# Altium schematic sheet coilcube_frontend_v2.SchDoc
size Letter
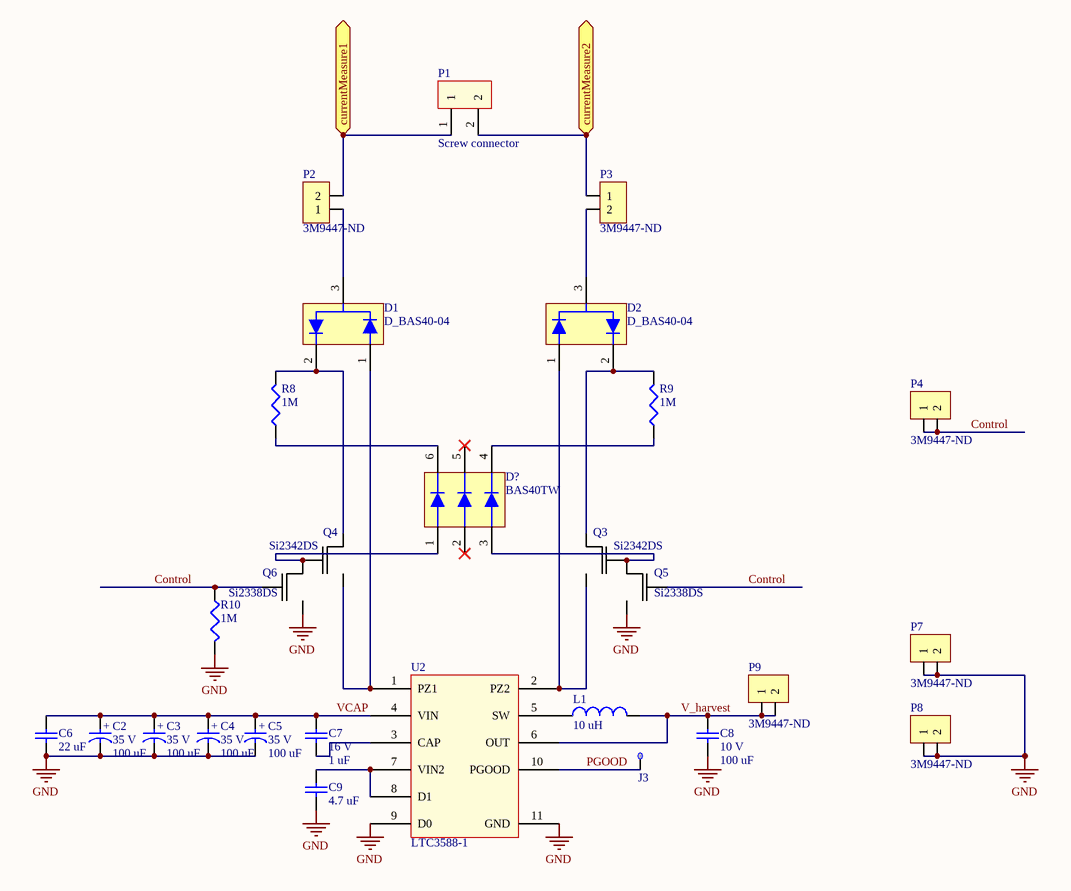
[diagram p0: coilcube_frontend_v2.SchDoc]

## Parts
C2  value 100 uF  voltage rated: 35 V  [KEMET_EDK_9H]  (hidden comment: Aluminum capacitor)
C3  value 100 uF  voltage rated: 35 V  [KEMET_EDK_9H]  (hidden comment: Aluminum capacitor)
C4  value 100 uF  voltage rated: 35 V  [KEMET_EDK_9H]  (hidden comment: Aluminum capacitor)
C5  value 100 uF  voltage rated: 35 V  [KEMET_EDK_9H]  (hidden comment: Aluminum capacitor)
C6  value 22 uF  [1206]  (hidden comment: Ceramic capacitor)
C7  value 1 uF  voltage rated: 16 V  [0603]  (hidden comment: Ceramic capacitor)
C8  value 100 uF  voltage rated: 10 V  [1210]  (hidden comment: Ceramic capacitor)
C9  value 4.7 uF  [0603]  (hidden comment: Ceramic capacitor)
D1  D_BAS40-04  [SOT23-3]
D2  D_BAS40-04  [SOT23-3]
D?  BAS40TW  [SOT-363]
J3  5004  [TestPoint]  (value not drawn)
L1  value 10 uH  [CDRH2D18]  (hidden comment: Chip inductor)
P1  Screw connector  [MPT_2position]
P2  Supplier Part Number 1: 3M9447-ND  [1x2 header]  (hidden comment: 1 x 2 header)
P3  Supplier Part Number 1: 3M9447-ND  [1x2 header]  (hidden comment: 1 x 2 header)
P4  Supplier Part Number 1: 3M9447-ND  [1x2 header]  (hidden comment: 1 x 2 header)
P7  Supplier Part Number 1: 3M9447-ND  [1x2 header]  (hidden comment: 1 x 2 header)
P8  Supplier Part Number 1: 3M9447-ND  [1x2 header]  (hidden comment: 1 x 2 header)
P9  Supplier Part Number 1: 3M9447-ND  [1x2 header]  (hidden comment: 1 x 2 header)
Q3  Si2342DS  [SOT23-3]
Q4  Si2342DS  [SOT23-3]
Q5  Si2338DS  [SOT23-3]
Q6  Si2338DS  [SOT23-3]
R8  value 1M  [0603]  (hidden comment: Chip resistor)
R9  value 1M  [0603]  (hidden comment: Chip resistor)
R10  value 1M  [0603]  (hidden comment: Chip resistor)
U2  LTC3588-1  [TSSOP50P490X110_HS-11N]

## Ports
currentMeasure1, currentMeasure2

## Nets
GND: C2.2 C3.2 C4.2 C5.2 C6.2 C8.2 C9.2 P7.1 P7.2 P8.1 P8.2 Q5.2(S) Q6.2(S) R10.1 U2.9(D0) U2.11(GND)
Control: P4.1 P4.2 Q5.1(G) Q6.1(G) R10.2
currentMeasure1: P1.1 P2.2 ; port currentMeasure1
currentMeasure2: P1.2 P3.1 ; port currentMeasure2
PGOOD: J3.1(TB) U2.10(PGOOD)
V_harvest: C8.1 L1.1 P9.1 P9.2 U2.6(OUT)
VCAP: C2.1 C3.1 C4.1 C5.1 C6.1 C7.1 U2.4(VIN)
NetC7_2: C7.2 U2.3(CAP)
NetC9_1: C9.1 U2.7(VIN2) U2.8(D1)
NetD1_1: D1.1 Q4.2(S) U2.1(PZ1)
NetD1_2: D1.2 Q4.3(D) R8.1
NetD1_3: D1.3 P2.1
NetD2_1: D2.1 Q3.2(S) U2.2(PZ2)
NetD2_2: D2.2 Q3.3(D) R9.1
NetD2_3: D2.3 P3.2
NetD?_1: D?.1 Q4.1(G) Q6.3(D)
NetD?_3: D?.3 Q3.1(G) Q5.3(D)
NetD?_4: D?.4 R9.2
NetD?_6: D?.6 R8.2
NetL1_2: L1.2 U2.5(SW)

Not connected (* = marked no-connect by the designer): D? 2* 5*

## Notes on the sheet
- Title
- Date:
- Author:
- Revision:
- Sheet
- of
- University of Michigan
- File:
- (in symbol C_100u_35V_aluminum) +

## Library data of the parts
C2-C5 = C_100u_35V_aluminum: Aluminum capacitor, 100 uF, 35 V, KEMET EDK 9H; tolerance: 20%; Manufacture: Kemet; Supplier 1: Digi-Key; Supplier Part Number 1: 399-6671-1-ND
C6 = C_22u_35V_1206_ceramic: Ceramic capacitor, 22 uF, 35 V, 1206 package; Manufacture: TDK; voltage rated: 35 V; tolerance: 20%; package: 1206; Supplier 1: Digi-Key; Supplier Part Number 1: 445-8045-1-ND
C7 = C_1u_16V_0603_ceramic: Ceramic capacitor, 1 uF, 16 V, 0603 package; Manufacture: TDK; tolerance: 10%; package: 0603; Supplier 1: Digi-Key; Supplier Part Number 1: 445-1604-1-ND
C8 = C_100u_10V_1210_ceramic: Ceramic capacitor, 100u, 1210 package; Manufacture: Samsung; tolerance: 20%; package: 2917; Supplier 1: Digi-Key; Supplier Part Number 1: 1276-3364-1-ND
C9 = C_4.7u_10V_0603_ceramic: Ceramic capacitor, 4.7u, 10V, 0603 package; Manufacture: TDK; tolerance: 20%; Temp rating: X5R; package: 0603; voltage rated: 10 V; Supplier 1: Digi-Key; Supplier Part Number 1: 445-7482-1-ND
D1 D2 = D_BAS40-04: SURFACE MOUNT SCHOTTKY BARRIER DIODE; Supplier 1: Digi-Key; Supplier Part Number 1: BAS40-04FDICT-ND
D? = D_BAS40TW: SURFACE MOUNT SCHOTTKY BARRIER DIODE ARRAYS; Supplier 1: Digi-Key; Supplier Part Number 1: BAS40TWDICT-ND
J3 = TestPoint: TEST POINT PC MINI .040"D YELLOW; Supplier 1: Digi-Key; Supplier Part Number 1: 5004K-ND; datasheet: http://mail.keyelco.com/ENG._DEPT/PDF%20CAT%20NO%20Drawings/5004.pdf
L1 = L_10uH_1A_180m: Chip inductor, 10 uH,  1A, 180 mOhm; tolerance: 30%; Supplier 1: Digi-Key; Supplier Part Number 1: 308-1959-1-ND
P1 = MPT_2POS: Screw connector 2 positions; Supplier 1: Digi-Key; Supplier Part Number 1: 277-1273-ND
P2-P4 P7-P9 = 1 x 2 header: 100 mils standard header; Supplier 1: Digi-Key
Q3 Q4 = Si2342DS: N-Channel 8 V (D-S) MOSFET; Supplier 1: Digi-Key; Supplier Part Number 1: SI2342DS-T1-GE3-ND
Q5 Q6 = Si2338DS: N-Channel 30 V (D-S) MOSFET; Supplier 1: Digi-Key; Supplier Part Number 1: SI2338DS-T1-GE3CT-ND
R8-R10 = R_1M_0603: Chip resistor, 1 Meg, 0603 package; tolerance: 1%; power: 1/10 W; package: 0603; Supplier 1: Digi-Key; Supplier Part Number 1: 541-1.00MHCT-ND
U2 = LTC3588-1: Piezoelectric Energy   Harvesting Power Supply; Supplier 1: Digi-Key; Supplier Part Number 1: LTC3588EMSE-1#PBF-ND